# Altium schematic sheet Power_supply.SchDoc
size A4
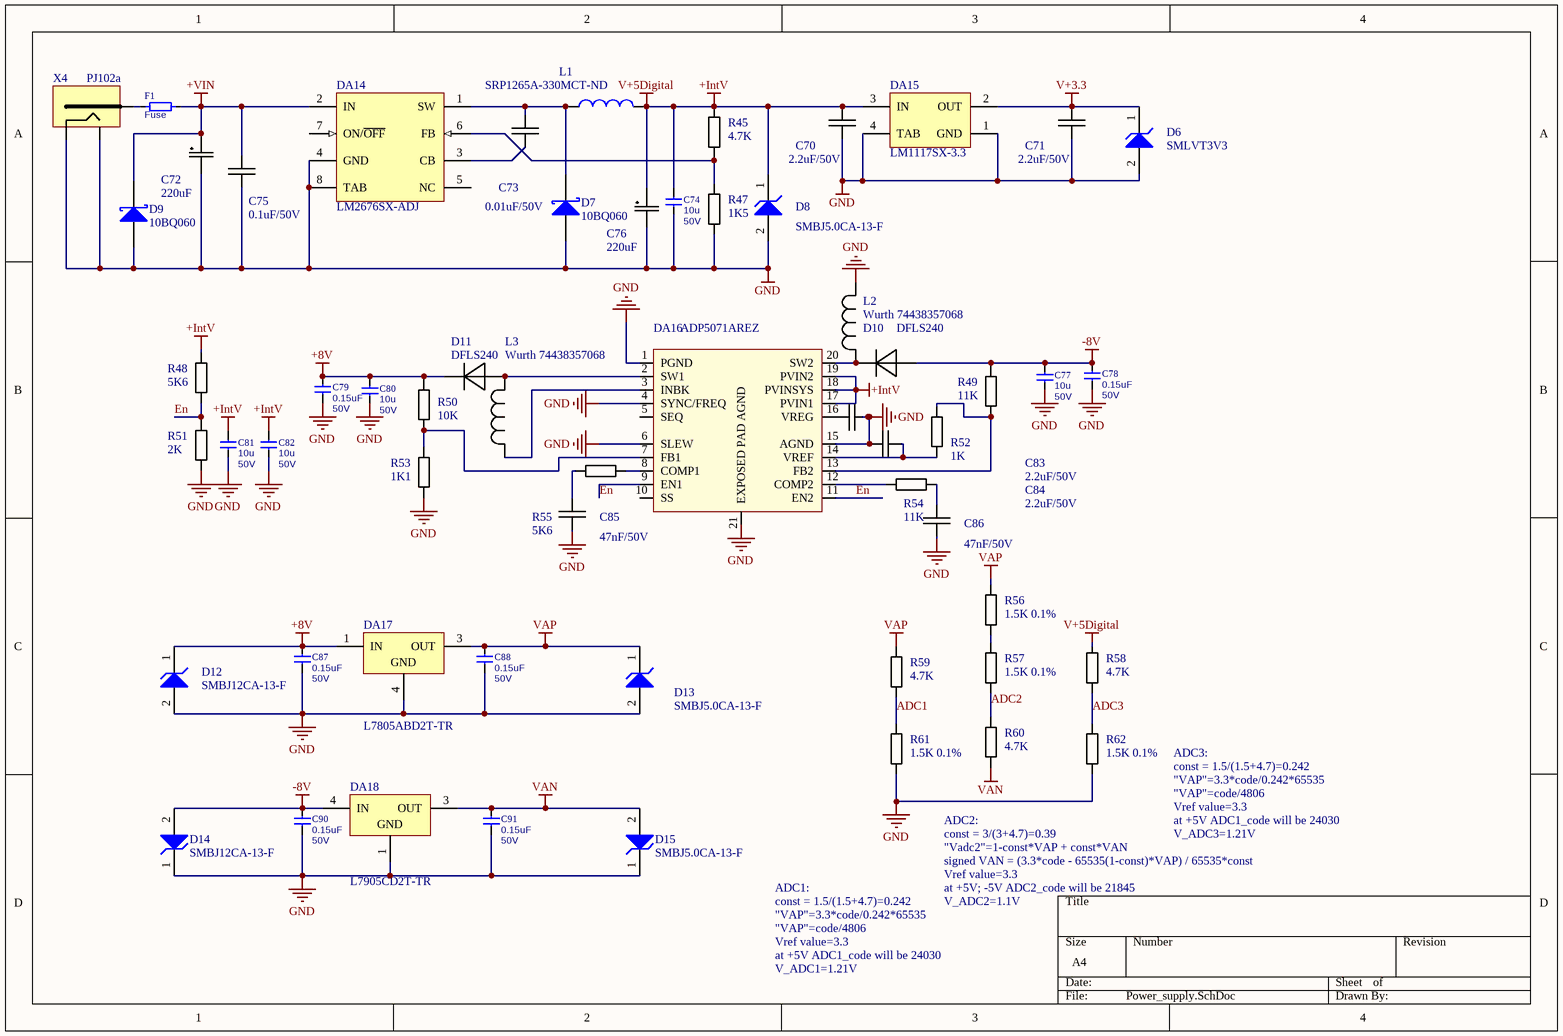
[diagram p0: Power_supply.SchDoc]

## Parts
C70  2.2uF/50V  [CAPACITOR 0603]
C71  2.2uF/50V  [CAPACITOR 0603]
C72  220uF  [CapacitorG]
C73  0.01uF/50V  [CAPACITOR 0603]
C74  Capacitance: 10u  Voltage: 50V  [C_1210]
C75  0.1uF/50V  [CAPACITOR 0603]
C76  220uF  [CapacitorG]
C77  Capacitance: 10u  Voltage: 50V  [C_1210]
C78  Capacitance: 0.15uF  Voltage: 50V  [C_1206]
C79  Capacitance: 0.15uF  Voltage: 50V  [C_1206]
C80  Capacitance: 10u  Voltage: 50V  [C_1210]
C81  Capacitance: 10u  Voltage: 50V  [C_1210]
C82  Capacitance: 10u  Voltage: 50V  [C_1210]
C83  2.2uF/50V  [CAPACITOR 0603]
C84  2.2uF/50V  [CAPACITOR 0603]
C85  47nF/50V  [CAPACITOR 0603]
C86  47nF/50V  [CAPACITOR 0603]
C87  Capacitance: 0.15uF  Voltage: 50V  [C_1206]
C88  Capacitance: 0.15uF  Voltage: 50V  [C_1206]
C90  Capacitance: 0.15uF  Voltage: 50V  [C_1206]
C91  Capacitance: 0.15uF  Voltage: 50V  [C_1206]
D6  SMLVT3V3  [ONSC-SMB-2-403A-03_H_V]
D7  10BQ060  [SMB]
D8  SMBJ5.0CA-13-F  [ONSC-SMB-2-403A-03_H_V]
D9  10BQ060  [SMB]
D10  DFLS240  [PowerDI™ 123]
D11  DFLS240  [PowerDI™ 123]
D12  SMBJ12CA-13-F  [ONSC-SMB-2-403A-03_H_V]
D13  SMBJ5.0CA-13-F  [ONSC-SMB-2-403A-03_H_V]
D14  SMBJ12CA-13-F  [ONSC-SMB-2-403A-03_H_V]
D15  SMBJ5.0CA-13-F  [ONSC-SMB-2-403A-03_H_V]
DA14  LM2676SX-ADJ  [TS7B_M]
DA15  LM1117SX-3.3  [TS3B_N]
DA16  ADP5071AREZ  [20-TSSOP_exposed_pad]
DA17  L7805ABD2T-TR  [TO-263_M]
DA18  L7905CD2T-TR  [TO-263_M]
F1  Fuse  [R_1206]
L1  SRP1265A-330MCT-ND  [Inductor_RLF12545]
L2  Wurth 74438357068  [Wurth74438357068]
L3  Wurth 74438357068  [Wurth74438357068]
R45  4.7K  [Resistor 0603]
R47  1K5  [Resistor 0603]
R48  5K6  [Resistor 0603]
R49  11K  [Resistor 0603]
R50  10K  [Resistor 0603]
R51  2K  [Resistor 0603]
R52  1K  [Resistor 0603]
R53  1K1  [Resistor 0603]
R54  11K  [Resistor 0603]
R55  5K6  [Resistor 0603]
R56  1.5K 0.1%  [Resistor 0603]
R57  1.5K 0.1%  [Resistor 0603]
R58  4.7K  [Resistor 0603]
R59  4.7K  [Resistor 0603]
R60  4.7K  [Resistor 0603]
R61  1.5K 0.1%  [Resistor 0603]
R62  1.5K 0.1%  [Resistor 0603]
X4  PJ102a  [Conn_pj-102a]

## Nets
+8V: C79.1 C80.2 C87.1 D11.2 D12.1(K) DA17.1(IN) R50.2
+IntV: C70.2 C74.2 C76.2 C81.2 C82.2 D8.1(K) DA15.3(IN) DA16.17(PVIN1) DA16.18(PVINSYS) DA16.19(PVIN2) L1.2 R45.2 R48.2 R58.2  [also labelled V+5Digital]
+VIN: C72.2 C75.2 D9.2(K) DA14.2(IN) F1.2
-8V: C77.2 C78.1 C90.1 D10.1 D14.2(A) DA18.4(IN) R49.2
GND: C70.1 C71.1 C72.1 C74.1 C75.1 C76.1 C77.1 C78.2 C79.2 C80.1 C81.1 C82.1 C83.1 C84.2 C85.1 C86.1 C87.2 C88.2 C90.2 C91.2 D6.2(A) D7.1(A) D8.2(A) D9.1(A) D12.2(A) D13.2(A) D14.1(K) D15.1(K) DA14.4(GND) DA14.8(TAB) DA15.1(GND) DA15.4(TAB) DA16.1(PGND) DA16.4(SYNC/FREQ) DA16.6(SLEW) DA16.15(AGND) DA16.21(EXPOSED_PAD_AGND) DA17.4(GND) DA18.1(GND) L2.1 R47.1 R51.1 R53.1 R61.1 R62.1 X4.2 X4.3
V+3.3: C71.2 D6.1(K) DA15.2(OUT)
VAN: C91.1 D15.2(A) DA18.3(OUT) R60.1
VAP: C88.1 D13.1(K) DA17.3(OUT) R56.2 R59.2
ADC1: R59.1 R61.2
ADC2: R57.1 R60.2
ADC3: R58.1 R62.2
En: DA16.9(EN1) DA16.11(EN2) R48.1 R51.2
NetC73_1: C73.1 DA14.3(CB)
NetC73_2: C73.2 D7.2(K) DA14.1(SW) L1.1
NetC83_2: C83.2 DA16.16(VREG)
NetC84_1: C84.1 DA16.14(VREF) R52.1
NetC85_2: C85.2 R55.2
NetC86_2: C86.2 R54.1
NetD10_2: D10.2 DA16.20(SW2) L2.2
NetD11_1: D11.1 DA16.2(SW1) L3.1
NetDA14_6: DA14.6(FB) R45.1 R47.2
NetDA16_3: DA16.3(INBK) L3.2
NetDA16_7: DA16.7(FB1) R50.1 R53.2
NetDA16_8: DA16.8(COMP1) R55.1
NetDA16_12: DA16.12(COMP2) R54.2
NetDA16_13: DA16.13(FB2) R49.1 R52.2
NetF1_1: F1.1 X4.1
NetR56_1: R56.1 R57.2

Not connected (* = marked no-connect by the designer): DA14 5(NC) 7(ON/~{OFF}); DA16 5(SEQ) 10(SS)

## Notes on the sheet
- "VAP"=3.3*code/0.242*65535
- const = 1.5/(1.5+4.7)=0.242
- ADC3:
- "Vadc2"=1-const*VAP + const*VAN
- const = 3/(3+4.7)=0.39
- ADC2:
- "VAP"=code/4806
- Vref value=3.3
- at +5V ADC1_code will be 24030
- V_ADC3=1.21V
- ADC1:
- signed VAN = (3.3*code - 65535(1-const)*VAP) / 65535*const
- at +5V; -5V ADC2_code will be 21845
- V_ADC2=1.1V
- V_ADC1=1.21V

## Library data of the parts
C70 C71 C83 C84 = Capasitor: Manufacturer_part_number: C1608X7R1A225K080AC; Value: 2.2uF/50V
C72 C76 = CapPolBarrel: Конденсатор электролит бочонок 5мм, диаметр 13; Manufacturer_part_number: UWT1V221MNL1GS; Value: 220uF
C73 = Capasitor: Manufacturer_part_number: CGA3E2X7R1H103K080AA; Value: 0.01uF/50V
C74 C77 C80-C82 = C_SMD_ceramic: Capacitor; Manufacturer_part_number: CGA6P3X7S1H106M250AB
C75 = Capasitor: Manufacturer_part_number: CGA3E2X7R1H104K080AA; Value: 0.1uF/50V
C78 C79 C87 C88 C90 C91 = C_SMD_ceramic: Capacitor; Manufacturer_part_number: ECP-U1C154MA5
C85 C86 = Capasitor: Manufacturer_part_number: C1608X8R1H473K080AA; Value: 47nF/50V
D6 D8 D12-D15 = 1SMB5.0AT3: 600 W Peak Power Zener Transient Voltage Suppressor, Unidirectional, 2-Pin SMB, Tape and Reel; Manufacturer: On Semiconductor; IR Max (uA): 800; PPK Max (W): 600; V(BR) Typ (V): 6.7; DatasheetVersion: Rev. 13; PackageVersion: Rev. H, 05/2011; PackageReference: SMB-2-403A-03_H; PackageDescription: 2-Pin Small Molded Package, J-Bend Lead, Body 4.33 x 3.625 mm; Supplier 1: Digi-Key; Supplier Part Number 1: 1SMB5.0AT3OSCT-ND; Supplier 2: Digi-Key; Supplier Part Number 2: 1SMB5.0AT3OSDKR-ND; Direction: Unidirectional; Packing: Tape and Reel; Mounting Technology: Surface Mount; PartNumber: 1SMB5.0AT3; ComponentLink1Description: Manufacturer URL; ComponentLink1URL: http://www.onsemi.com/; ComponentLink2Description: Datasheet; ComponentLink2URL: http://www.onsemi.com/pub_link/Collateral/1SMB5.0AT3-D.PDF; ComponentLink3Description: Package Specification; ComponentLink3URL: http://www.onsemi.com/pub_link/Collateral/1SMB5913BT3-D.PDF
  D6: Manufacturer_part_number: SMLVT3V3
  D8 D13 D15: Manufacturer_part_number: SMBJ5.0CA-13-F
  D12 D14: Manufacturer_part_number: SMBJ12CA-13-F
D7 D9 = 10BQ060: Schottky Rectifier; Manufacturer_part_number: 10BQ060TR; Published: 8-Jun-2000; LatestRevisionDate: 17-Jul-2002; LatestRevisionNote: Re-released for DXP Platform.; DatasheetVersion: PD-2.438A; PackageReference: SMB; Publisher: Altium Limited; PackageDescription: DO-214-AA/SMB; 2 C-Bend Leads; Body 5.3 x 3.6 mm, inc. leads (LxW); ComponentLink1Description: Manufacturer Link; ComponentLink1URL: http://www.irf.com/; ComponentLink2Description: Datasheet; ComponentLink2URL: http://www.irf.com/product-info/datasheets/data/10bq60.pdf
D10 D11 = DFLS240: Manufacturer_part_number: DFLS240L-7
DA14 = LM2676S-3.3: SIMPLE SWITCHER® High Efficiency 3A Step-Down Voltage Regulator, 7-pin TO-263; Manufacturer: National Semiconductor; PackageTopMarking: NSUZXYTTE#*LM2676*S-3.3; PowerWise: N; High-Reliability: Y; DatasheetVersion: Feb-2008; PackageVersion: revE, Jul-2003; PackageReference: TS7B; PackageDescription: TO-263, Molded, .400 x .390 x .180in Body, 7 Lead, .050in Pitch, Surface Mount; PartNumber: LM2676S-3.3; RoHS: N; PinCount: 7; CompType: Switcher; Code_JEDEC: MO-169-AC; ComponentLink1Description: Manufacturer URL; ComponentLink1URL: http://www.national.com/; ComponentLink2Description: LM2676 Datasheet; ComponentLink2URL: http://www.national.com/ds/LM/LM2676.pdf; ComponentLink3Description: LM2676 Web Page; ComponentLink3URL: http://www.national.com/pf/LM/LM2676.html; ComponentLink4Description: TS7B Package Page; ComponentLink4URL: http://www.national.com/packaging/folders/ts7b.html; Manufacturer_part_number: LM2676SX-ADJ
DA15 = LM1117SX-3.3: 800mA Low-Dropout Linear Regulator, 3-pin TO-263; Manufacturer: National Semiconductor; Manufacturer_part_number: LM1117SX-3.3/NOPB; PackageTopMarking: NSUZXYTTE#*LM1117S*3.3; PowerWise: N; CompType: LDO IC; High-Reliability: Y; DatasheetVersion: Apr-2006; PackageVersion: revF, Apr-2005; PackageReference: TS3B; PackageDescription: TO-263, Molded, .400 x .390 x .180in, 3 Lead, .1in Pitch, Surface Mount; PartNumber: LM1117SX-3.3; RoHS: N; PinCount: 3; Code_JEDEC: MO-169-AA; ComponentLink1Description: Manufacturer URL; ComponentLink1URL: http://www.national.com/; ComponentLink2Description: LM1117 Datasheet; ComponentLink2URL: http://www.national.com/ds/LM/LM1117.pdf; ComponentLink3Description: LM1117 Web Page; ComponentLink3URL: http://www.national.com/pf/LM/LM1117.html; ComponentLink4Description: TS3B Package Page; ComponentLink4URL: http://www.national.com/packaging/folders/ts3b.html
DA16 = ADP5071: Manufacturer p/n: ADP5071AREZ; Digi-Key P/N: ADP5071AREZ-ND; Manufacturer_part_number: ADP5071AREZ
DA17 = L7805ABD2T-TR: Positive Voltage Regulator, 3-Pin D2PAK, Tape and Reel; DatasheetVersion: Nov-2011; PackageVersion: 2011; PackageReference: TO-263; PackageDescription: 3-Pin Transistor Outline Package 2.54 mm Pitch, 15.4 mm Lead Span (D2PAK); PartNumber: L7805ABD2T-TR; ComponentLink1Description: Manufacturer URL; ComponentLink1URL: http://www.st.com; ComponentLink2Description: Datasheet; ComponentLink2URL: http://www.st.com/internet/com/TECHNICAL_RESOURCES/TECHNICAL_LITERATURE/DATASHEET/CD00000444.pdf
DA18 = L7905CD2T-TR: Negative Voltage Regulator, -5V, 3-Pin D2PAK, Tape and Reel; DatasheetVersion: Nov-2011; PackageVersion: 2011; PackageReference: TO-263; PackageDescription: 3-Pin Transistor Outline Package 2.54 mm Pitch, 15.4 mm Lead Span (D2PAK); PartNumber: L7905CD2T-TR; ComponentLink1Description: Manufacturer URL; ComponentLink1URL: http://www.st.com; ComponentLink2Description: Datasheet; ComponentLink2URL: http://www.st.com/internet/com/TECHNICAL_RESOURCES/TECHNICAL_LITERATURE/DATASHEET/CD00000450.pdf
F1 = R1206: Resistor; Manufacturer_part_number: NANOSMDH075F-02; Value: Fuse
L1 = Inductor_RLF12545: Value: SRP1265A-330MCT-ND; Manufacturer_part_number: SRP1265A-330MCT-ND
L2 L3 = L: Manufacturer_part_number: Wurth 74438357068
R45 R58-R60 = Resistor: Manufacturer_part_number: ERJ-3EKF4701V; Value: 4.7K
R47 R56 R57 R61 R62 = Resistor: Manufacturer_part_number: ERJ-PB3B1501V
  R47: Value: 1K5
  R56 R57 R61 R62: Value: 1.5K 0.1%
R48 R55 = Resistor: Manufacturer_part_number: ERJ-3EKF5601V; Value: 5K6
R49 R54 = Resistor: Manufacturer_part_number: ERJ-3EKF1102V; Value: 11K
R50 = Resistor: Manufacturer_part_number: ERJ-3EKF1002V; Value: 10K
R51 = Resistor: Manufacturer_part_number: ERJ-3EKF2001V; Value: 2K
R52 = Resistor: Manufacturer_part_number: ERJ-3EKF1001V; Value: 1K
R53 = Resistor: Manufacturer_part_number: ERJ-3EKF1101V; Value: 1K1
X4 = PJ102a: PJ-102A barrel jack 2.1x5.5x9.0mm